# EAGLE schematic MAX4239basedV2 (EAGLE 8.5.1)
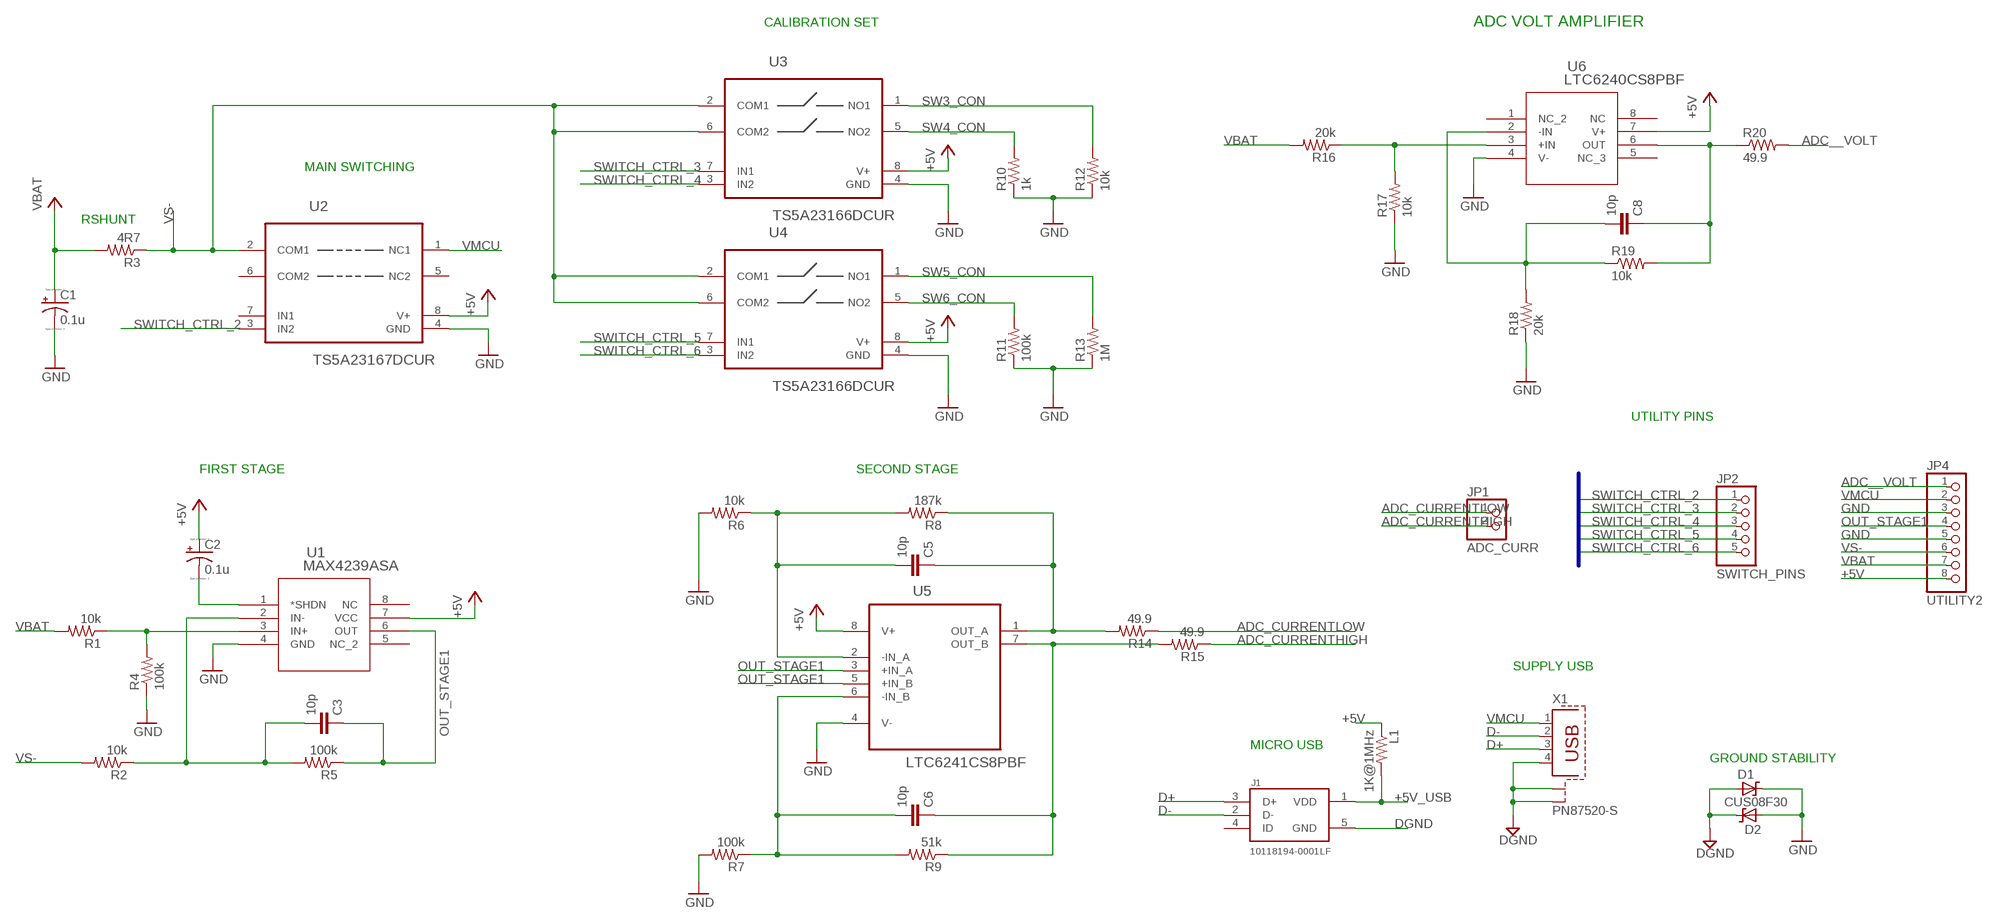
[diagram p0: schematic, sheet 1]

## Parts
C1  0.1u  CPOL-USB  [PANASONIC_B]
C2  0.1u  CPOL-USB  [PANASONIC_B]
C3  10p  C-EUC0805  [C0805]
C5  10p  C-EUC0805  [C0805]
C6  10p  C-EUC0805  [C0805]
C8  10p  C-EUC0805  [C0805]
D1  CUS08F30  [SOD323]
D2  CUS08F30  [SOD323]
J1  10118194-0001LF  [FRAMATOME_10118194-0001LF]
JP1  ADC_CURR  PINHD-1X2  [1X02]
JP2  SWITCH_PINS  PINHD-1X5  [1X05]
JP4  UTILITY2  PINHD-1X8  [1X08]
L1  1K@1MHz  R-US_R0805  [R0805]
R1  10k  R-US_R0805  [R0805]
R2  10k  R-US_R0805  [R0805]
R3  4R7  R-US_R0805  [R0805]
R4  100k  R-US_R0805  [R0805]
R5  100k  R-US_R0805  [R0805]
R6  10k  R-US_R0805  [R0805]
R7  100k  R-US_R0805  [R0805]
R8  187k  R-US_R0805  [R0805]
R9  51k  R-US_R0805  [R0805]
R10  1k  R-US_R0805  [R0805]
R11  100k  R-US_R0805  [R0805]
R12  10k  R-US_R0805  [R0805]
R13  1M  R-US_R0805  [R0805]
R14  49.9  R-US_R0805  [R0805]
R15  49.9  R-US_R0805  [R0805]
R16  20k  R-US_R0805  [R0805]
R17  10k  R-US_R0805  [R0805]
R18  20k  R-US_R0805  [R0805]
R19  10k  R-US_R0805  [R0805]
R20  49.9  R-US_R0805  [R0805]
U1  MAX4239ASA  [21-0041B_8]
U2  TS5A23167DCUR  [SOP50P310X90-8N]
U3  TS5A23166DCUR  [SOP50P310X90-8N]
U4  TS5A23166DCUR  [SOP50P310X90-8N]
U5  LTC6241CS8PBF  [SOIC127P600X175-8N]
U6  LTC6240CS8PBF  [SO-8_S]
X1  PN87520-S  [PN87520-S]

## Nets
+5V: C2.+ JP4.8 L1.1 U1.7(VCC) U2.8(V+) U3.8(V+) U4.8(V+) U5.8(V+) U6.7(V+)
+5V_USB: J1.1(VDD) L1.2
ADC__VOLT: JP4.1 R20.2
ADC_CURRENTHIGH: JP1.2 R15.1
ADC_CURRENTLOW: JP1.1 R14.1
D+: J1.3(D+) X1.3
D-: J1.2(D-) X1.2
DGND: D1.A D2.C J1.5(GND) X1.4 X1.S1 X1.S2
GND: C1.- D1.C D2.A JP4.3 JP4.5 R4.1 R6.2 R7.2 R10.1 R11.1 R12.1 R13.1 R17.1 R18.1 U1.4(GND) U2.4(GND) U3.4(GND) U4.4(GND) U5.4(V-) U6.4(V-)
N$1: R16.1 R17.2 U6.3(+IN)
N$2: C8.1 R19.2 R20.1 U6.6(OUT)
N$4: C8.2 R18.2 R19.1 U6.2(-IN)
N$7: C5.1 R8.1 R14.2 U5.1(OUT_A)
N$9: C2.- U1.1(*SHDN)
N$10: C3.2 R2.1 R5.2 U1.2(IN-)
N$11: C6.1 R9.1 R15.2 U5.7(OUT_B)
N$12: R1.1 R4.2 U1.3(IN+)
N$13: C5.2 R6.1 R8.2 U5.2(-IN_A)
N$15: C6.2 R7.1 R9.2 U5.6(-IN_B)
OUT_STAGE1: C3.1 JP4.4 R5.1 U1.6(OUT) U5.3(+IN_A) U5.5(+IN_B)
SW3_CON: R12.2 U3.1(NO1)
SW4_CON: R10.2 U3.5(NO2)
SW5_CON: R13.2 U4.1(NO1)
SW6_CON: R11.2 U4.5(NO2)
SWITCH_CTRL_2: JP2.1 U2.3(IN2)
SWITCH_CTRL_3: JP2.2 U3.7(IN1)
SWITCH_CTRL_4: JP2.3 U3.3(IN2)
SWITCH_CTRL_5: JP2.4 U4.7(IN1)
SWITCH_CTRL_6: JP2.5 U4.3(IN2)
VBAT: C1.+ JP4.7 R1.2 R3.2 R16.2
VMCU: JP4.2 U2.1(NC1) X1.1
VS-: JP4.6 R2.2 R3.1 U2.2(COM1) U3.2(COM1) U3.6(COM2) U4.2(COM1) U4.6(COM2)
Unconnected: J1.4(ID) U1.5(NC_2) U1.8(NC) U2.5(NC2) U2.6(COM2) U2.7(IN1) U6.1(NC_2) U6.5(NC_3) U6.8(NC)

## Buses
SWITCH_CTRL_[1..6]

## Notes on the sheet
- CALIBRATION SET | ADC VOLT AMPLIFIER
- MAIN SWITCHING
- RSHUNT
- UTILITY PINS
- FIRST STAGE | SECOND STAGE
- SUPPLY USB
- MICRO USB
- GROUND STABILITY

## Library data of the parts
C1 C2 = resistor:CPOL-US: POLARIZED CAPACITOR, American symbol
C3 C5 C6 C8 = resistor:C-EU: CAPACITOR, European symbol
D1 D2 = CUS08F30:CUS08F30: http://octopart.com/1n4148ws-v-gs08-vishay+semiconductor-40871699; DESCRIPTION: DIODE SCHOTTKY 30V 800MA USC, 220mV @ 10mA, SOD-23 OR SC-76; MF: TOSHIBA; MP: CUS08F30; PACKAGE: SOD-323 Vishay Semiconductor; PRICE: None
J1 = 10118194-0001LF:10118194-0001LF: Conn Micro USB Type B RCP 5 POS 0.65mm Solder RA SMD 5 Terminal 1 Port T/R; AVAILABILITY: Good; DESCRIPTION: Conn Micro USB Type B RCP 5 POS 0.65mm Solder RA SMD 5 Terminal 1 Port T/R; MF: Amphenol; MP: 10118194-0001LF; PACKAGE: DIP-4 FCI; PRICE: 0.24 USD
JP1 = pinhead:PINHD-1X2: PIN HEADER
JP2 = pinhead:PINHD-1X5: PIN HEADER
JP4 = pinhead:PINHD-1X8: PIN HEADER
L1 R1-R20 = resistor:R-US_: RESISTOR, American symbol
U1 = MAX4239ASA:MAX4239ASA; AVAILABILITY: Warning; DESCRIPTION: Linear IC - Op-amp Maxim Integrated MAX4239ASA+ Multi-purpose SOIC 8 N; MF: Maxim Integrated; MP: MAX4239ASA+; PACKAGE: SOIC-8 Maxim Integrated; PRICE: 2.22 USD
U2 = TS5A2316XDCUR:TS5A23167DCUR: SPST ANALOG SWITCH; AVAILABILITY: Good; DESCRIPTION: 0.9-Ohm Dual SPST Analog Switch 5-V/3.3-V 2-Channel Analog Switch 8-VSSOP -40 to 85; MF: Texas Instruments; MP: TS5A23167DCUR; PACKAGE: VFSOP-8 Texas Instruments; PRICE: 0.46 USD
U3 U4 = TS5A2316XDCUR:TS5A23166DCUR: SPST ANALOG SWITCH; AVAILABILITY: Good; DESCRIPTION: 0.9-Ohm Dual SPST Analog Switch 5-V/3.3-V 2-Channel Analog Switch 8-VSSOP -40 to 85; MF: Texas Instruments; MP: TS5A23166DCUR; PACKAGE: VFSOP-8 Texas Instruments; PRICE: 0.46 USD
U5 = LTC6241CS8PBF:LTC6241CS8PBF: Low Noise, Rail-to-Rail Output,CMOS Op Amps; AVAILABILITY: Good; DESCRIPTION: LTC6241 - Dual 18MHz, Low Noise, Rail-to-Rail Output, CMOS Op Amp; MF: Linear Technology; MP: LTC6241CS8#PBF; PACKAGE: SO-8 Linear Technology; PRICE: 2.03 USD
U6 = LTC6240CS8PBF:LTC6240CS8PBF; AVAILABILITY: Good; DESCRIPTION: LTC6240 Op Amp CMOS R-R SOICN-8; MF: Linear Technology; MP: LTC6240CS8#PBF; PACKAGE: SOIC-8 Linear Technology; PRICE: 1.20 USD
X1 = con-berg:PN87520-S; OC_FARNELL: unknown; OC_NEWARK: unknown